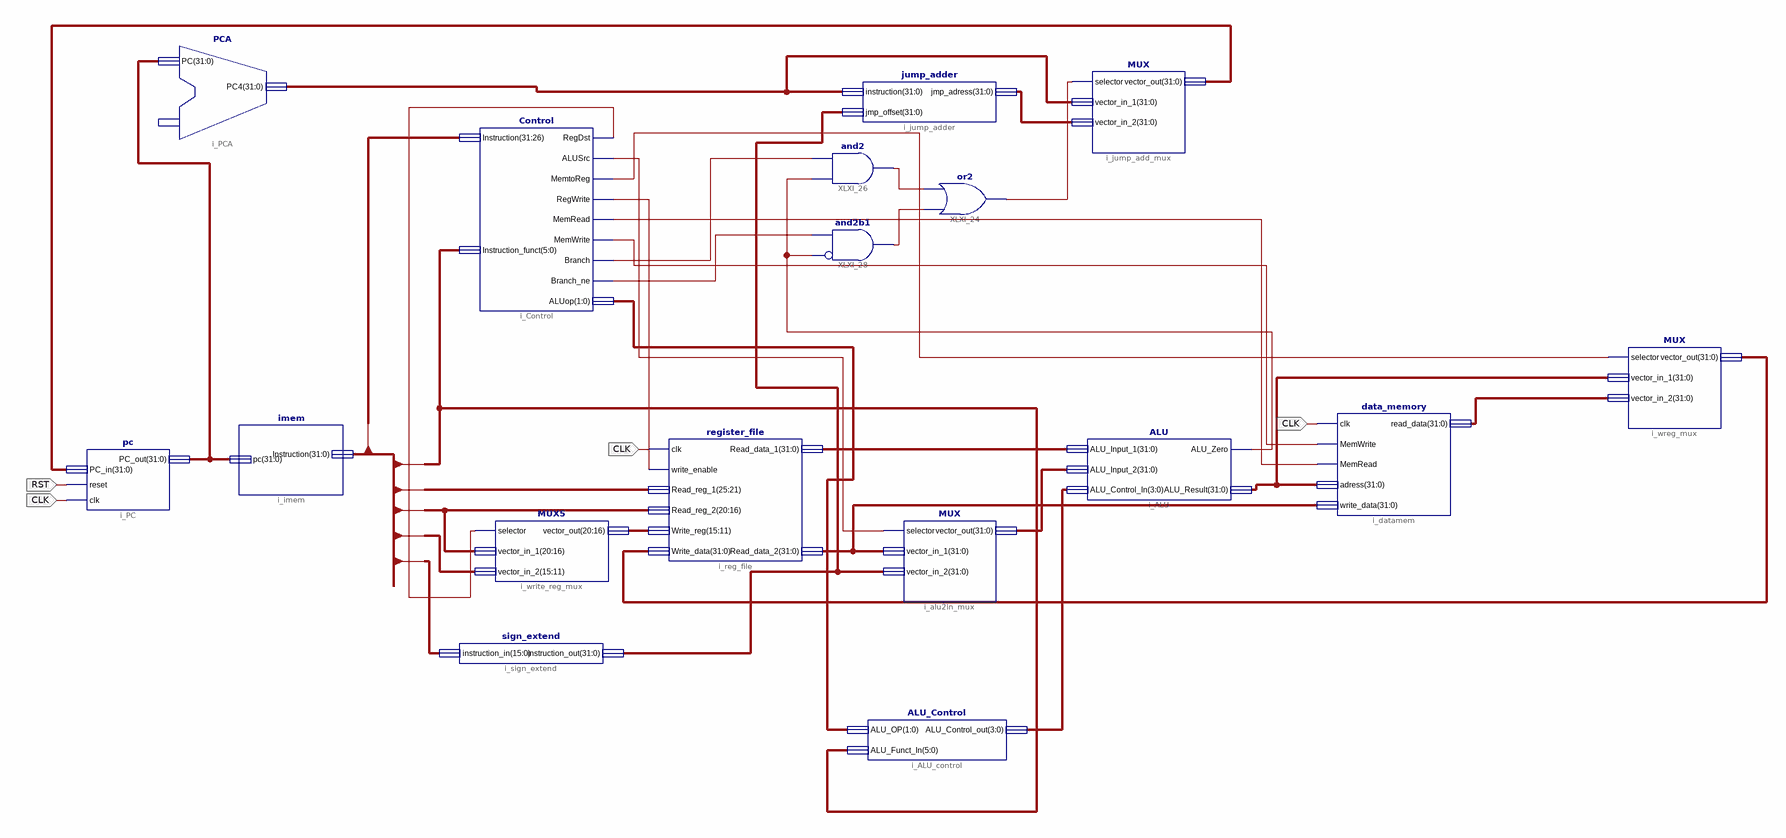
[diagram p0: schematic sheet 1]
// Xilinx ISE schematic toplevel.sch (spartan6) as structural Verilog: 17 symbols, 2 ports
module toplevel (
  input  RST,
  input  CLK
);

  wire XLXN_46, XLXN_48, XLXN_49, XLXN_50, XLXN_51, XLXN_54, XLXN_63, XLXN_64, XLXN_66, XLXN_67, XLXN_68,
       XLXN_77;
  wire [1:0] XLXN_72;
  wire [3:0] XLXN_35;
  wire [15:11] XLXN_74;
  wire [31:0] ALU_res, XLXN_7, XLXN_20, XLXN_21, XLXN_27, XLXN_28, XLXN_29, XLXN_32, XLXN_44, XLXN_57,
       XLXN_62, XLXN_133;

  imem i_imem (.pc(XLXN_133), .Instruction(XLXN_7));
  PCA i_PCA (.PC(XLXN_133), .PC4(XLXN_20));
  Control i_Control (
    .Instruction(XLXN_7[31:26]), .RegDst(XLXN_77), .ALUSrc(XLXN_63), .MemtoReg(XLXN_68), .RegWrite(XLXN_64),
    .MemRead(XLXN_67), .MemWrite(XLXN_66), .Branch(XLXN_50), .Branch_ne(XLXN_54), .ALUop(XLXN_72),
    .Instruction_funct(XLXN_7[5:0]));
  register_file i_reg_file (
    .clk(CLK), .write_enable(XLXN_64), .Read_reg_1(XLXN_7[25:21]), .Read_reg_2(XLXN_7[20:16]),
    .Write_reg(XLXN_74), .Write_data(XLXN_62), .Read_data_1(XLXN_21), .Read_data_2(XLXN_27));
  pc i_PC (.PC_out(XLXN_133), .PC_in(XLXN_57), .clk(CLK), .reset(RST));
  sign_extend i_sign_extend (.instruction_in(XLXN_7[15:0]), .instruction_out(XLXN_28));
  ALU i_ALU (
    .ALU_Input_1(XLXN_21), .ALU_Input_2(XLXN_29), .ALU_Control_In(XLXN_35), .ALU_Result(ALU_res),
    .ALU_Zero(XLXN_51));
  MUX i_alu2in_mux (.selector(XLXN_63), .vector_in_1(XLXN_27), .vector_in_2(XLXN_28), .vector_out(XLXN_29));
  jump_adder i_jump_adder (.instruction(XLXN_20), .jmp_offset(XLXN_28), .jmp_adress(XLXN_32));
  ALU_Control i_ALU_control (.ALU_OP(XLXN_72), .ALU_Funct_In(XLXN_7[5:0]), .ALU_Control_out(XLXN_35));
  data_memory i_datamem (
    .clk(CLK), .MemWrite(XLXN_66), .MemRead(XLXN_67), .adress(ALU_res), .write_data(XLXN_27),
    .read_data(XLXN_44));
  and XLXI_26 (XLXN_49, XLXN_51, XLXN_50);
  and XLXI_28 (XLXN_48, ~XLXN_51, XLXN_54);  // and2b1
  MUX i_jump_add_mux (.selector(XLXN_46), .vector_in_1(XLXN_20), .vector_in_2(XLXN_32), .vector_out(XLXN_57));
  or XLXI_24 (XLXN_46, XLXN_48, XLXN_49);
  MUX i_wreg_mux (.selector(XLXN_68), .vector_in_1(ALU_res), .vector_in_2(XLXN_44), .vector_out(XLXN_62));
  MUX5 i_write_reg_mux (
    .selector(XLXN_77), .vector_in_1(XLXN_7[20:16]), .vector_in_2(XLXN_7[15:11]), .vector_out(XLXN_74));
endmodule
